# Altium schematic sheet bmsMaster_power.SchDoc
size A; SheetNumber: 3; SheetTotal: 6
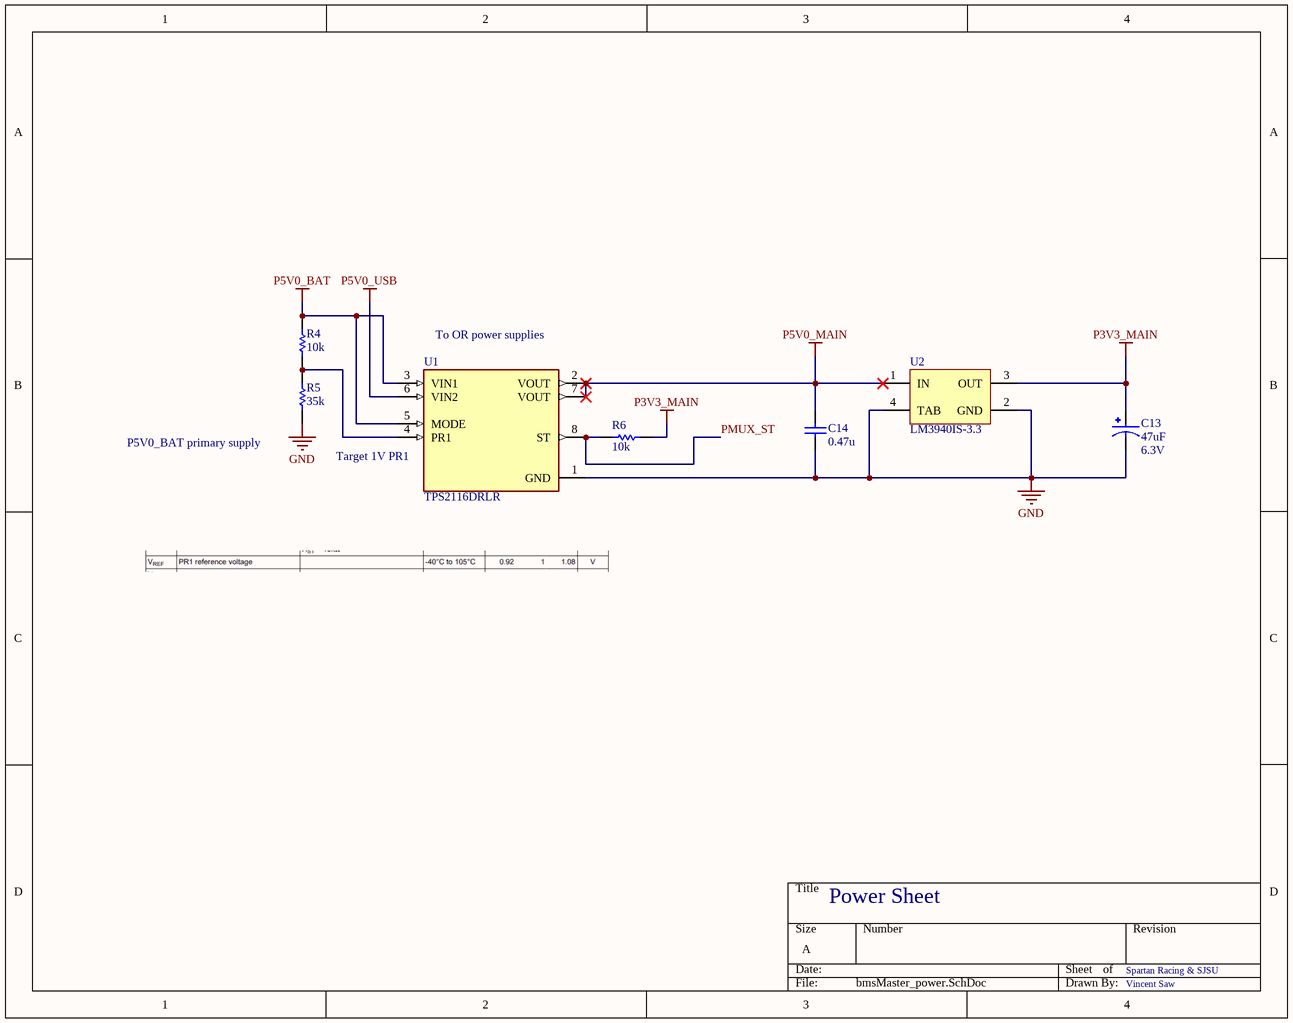
[diagram p0: bmsMaster_power.SchDoc]

## Parts
C13  value 47uF  Rating: 6.3V  [CAP_EEEHA0J470WR]  (hidden comment: EEEHA0J470WR)
C14  value 0.47u  (hidden comment: Capacitor)
R4  value 10k  (hidden comment: Resistor)
R5  value 35k  (hidden comment: Resistor)
R6  value 10k  (hidden comment: Resistor)
U1  TPS2116DRLR  [SOTFL50P160X60-8N]
U2  LM3940IS-3.3  [KTT0003B_N]

## Nets
GND: C13.2 C14.1 R5.1 U1.1(GND) U2.2(GND) U2.4(TAB)
P3V3_MAIN: C13.1 R6.1 U2.3(OUT)
P5V0_BAT: R4.2 U1.3(VIN1) U1.5(MODE)
P5V0_MAIN: C14.2 U1.2(VOUT) U1.7(VOUT) U2.1(IN)
P5V0_USB: U1.6(VIN2)
PMUX_ST: R6.2 U1.8(ST)
NetR4_1: R4.1 R5.2 U1.4(PR1)

## Notes on the sheet
- (near U1) To OR power supplies
- (near R5) P5V0_BAT primary supply
- (near U1) Target 1V PR1
- Power Sheet
- Spartan Racing & SJSU
- Vincent Saw

## Library data of the parts
C13 = EEEHA0J470WR: MF: {'manufacturer': u'Panasonic'}; Package: None; Price: None; MP: EEEHA0J470WR; Availability: Unavailable
C14 = Capacitor: SimulationGenericComponent: True
R4-R6 = Resistor: TC1: 0; SimulationGenericComponent: True; TC2: 0
U1 = TPS2116DRLR: 1.6 V to 5.5 V, 2.5-A Low IQ Power Mux with Manual and Priority Switchover; MF: {'manufacturer': u'Texas Instruments'}; Value: *; Price: None; Package: None; Availability: Unavailable; MP: TPS2116DRLR
U2 = CMP-0062-00201-4: 1A Low Dropout Regulator for 5V to 3.3V Conversion, 3-pin TO-263; Manufacturer: Texas Instruments; CompType: LDO IC; PowerWise: N; PackageTopMarking: NSUZXYTTE#*LM3940IS*-3.3 P+; PinCount: 3; Code_JEDEC: MO-169-AA; PackageReference: KTT0003B; ComponentLink1URL: http://www.ti.com/general/docs/lit/getliterature.tsp?genericPartNumber=LM3940&fileType=pdf; RoHS: N; PackageDescription: TO-263, Molded, .400 x .390 x .180in, 3 Lead, .1in Pitch, Surface Mount; ComponentLink1Description: Datasheet URL